# EAGLE design RFD900module (EAGLE 6.3)
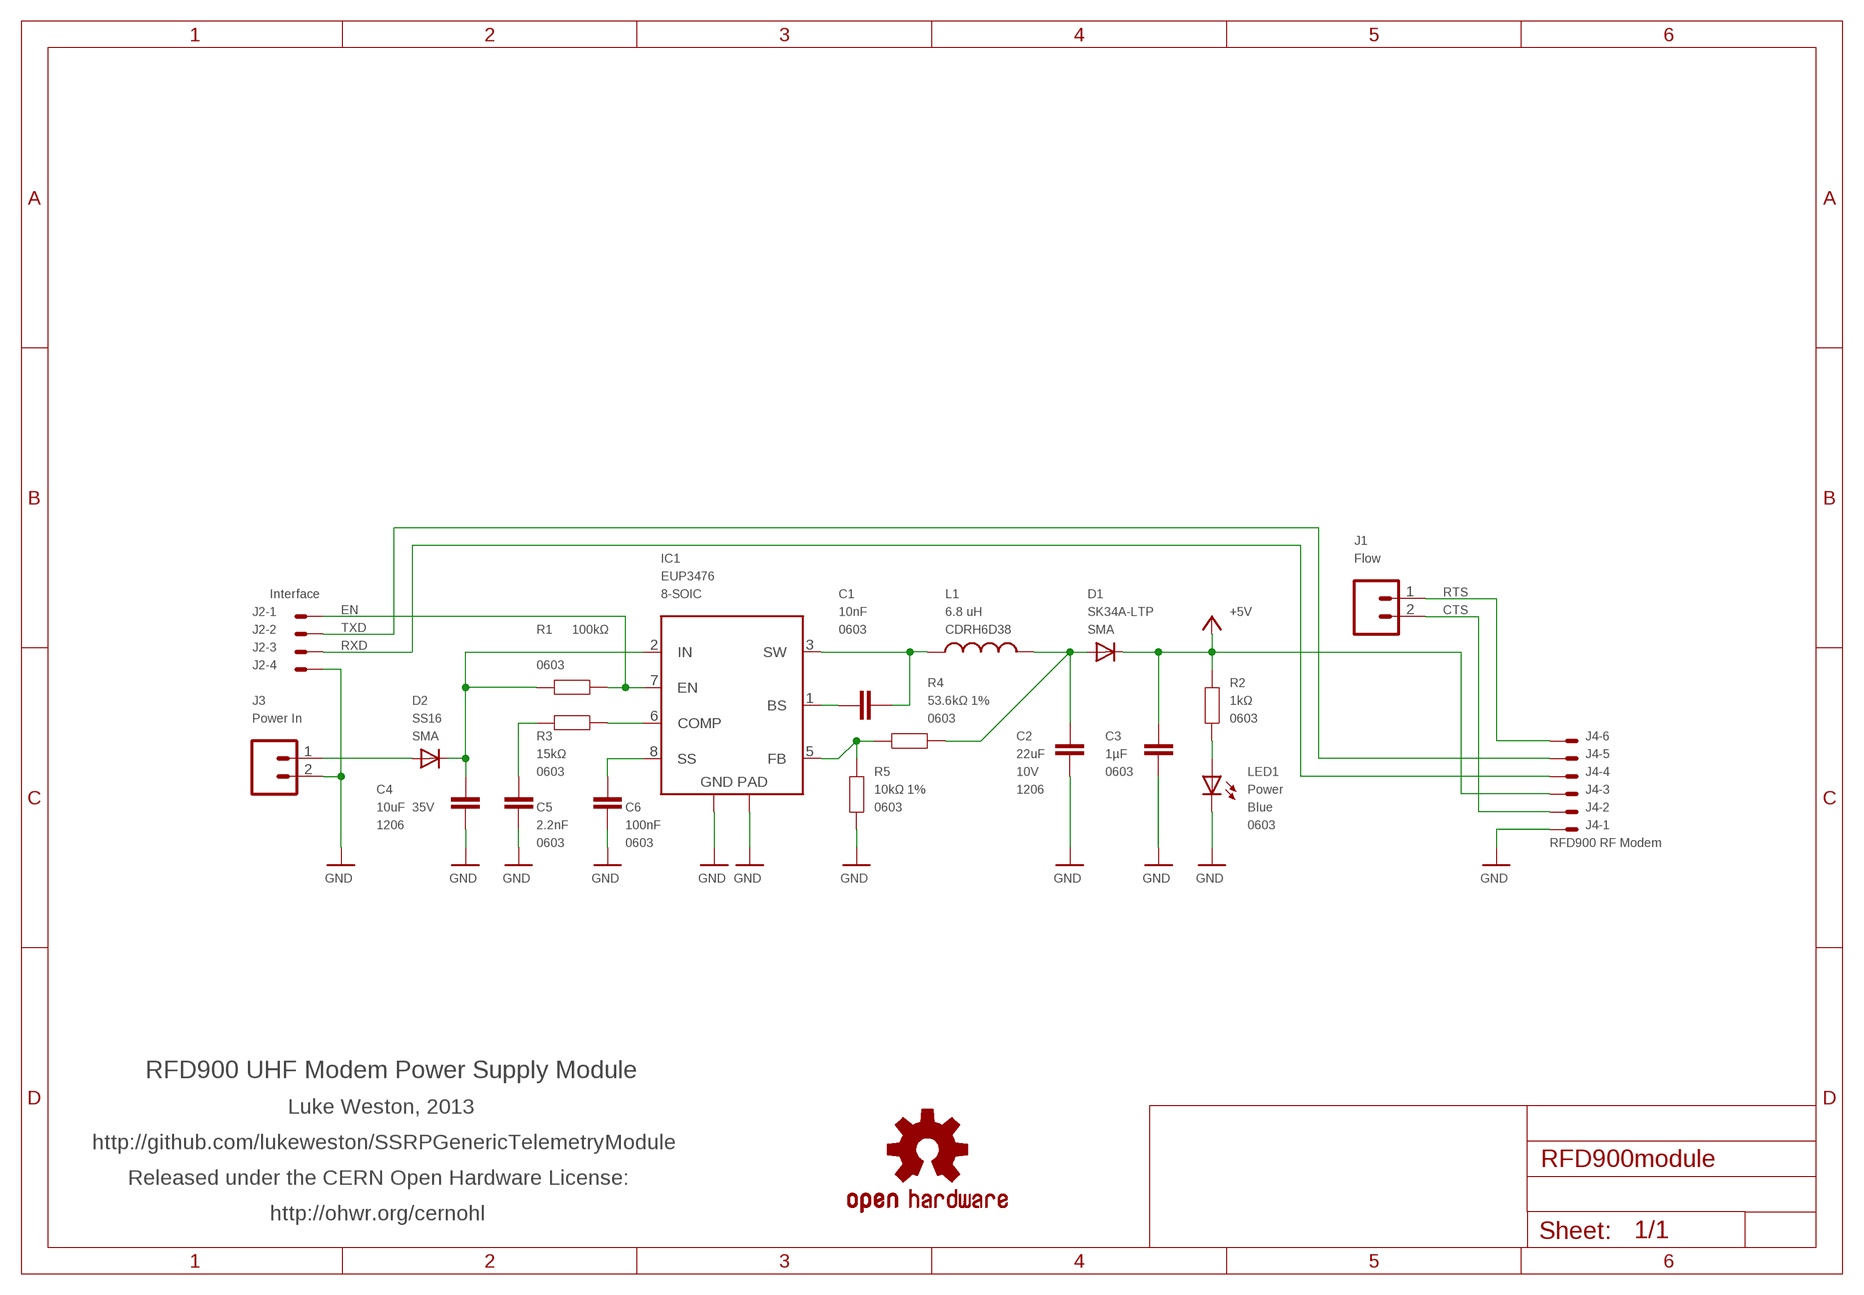
[diagram p0: schematic, sheet 1]

## Parts
C1  10nF  CAP0603  [0603]
C2  22uF  C-EUC1206  [C1206]
C3  1µF  CAP0603  [0603]
C4  10uF  C-EUC1206  [C1206]
C5  2.2nF  CAP0603  [0603]
C6  100nF  CAP0603  [0603]
D1  SK34A-LTP  DIODESMA  [SMA-DIODE]
D2  SS16  DIODESMAB  [SMA-SMB-DIODE]
IC1  EUP3476  [SO08T]
J1  Flow  M02PTH  [1X02]
J2  Interface  22-05-7048-04  [7395-04]
J3  Power In  M023.5MM  [SCREWTERMINAL-3.5MM-2]
J4  RFD900 RF Modem  22-05-7068-06  [7395-06]
L1  6.8 uH  INDUCTOR  [CDRH]
LED1  Power  LED0603  [LED-0603]
R1  100kΩ  RESISTOR0603  [0603]
R2  1kΩ  RESISTOR0603  [0603]
R3  15kΩ  RESISTOR0603  [0603]
R4  53.6kΩ 1%  RESISTOR0603  [0603]
R5  10kΩ 1%  RESISTOR0603  [0603]
SY  OSHW-LOGOS  [OSHW-LOGO-S]

## Nets
+5V: C3.2 D1.C J4.3 R2.1
CTS: J1.2 J4.2
EN: IC1.7(EN) J2.1 R1.1
GND: C2.2 C3.1 C4.2 C5.1 C6.1 IC1.4(GND) IC1.9(TGND) J2.4 J3.2 J4.1 LED1.C R5.2
N$1: D2.A J3.1
N$3: LED1.A R2.2
N$5: C2.1 D1.A L1.2 R4.2
N$18: C1.1 IC1.3(SW) L1.1
N$19: C1.2 IC1.1(BS)
N$20: C5.2 R3.2
N$21: IC1.6(COMP) R3.1
N$22: C6.2 IC1.8(SS)
N$23: IC1.5(FB) R4.1 R5.1
RTS: J1.1 J4.6
RXD: J2.3 J4.4
TXD: J2.2 J4.5
VIN: C4.1 D2.C IC1.2(IN) R1.2

## Notes on the sheet
- RFD900 UHF Modem Power Supply Module
- Luke Weston, 2013
- http://github.com/lukeweston/SSRPGenericTelemetryModule
- Released under the CERN Open Hardware License:
- http://ohwr.org/cernohl

## Library data of the parts
C1 C3 C5 C6 = freetronics-master-v1:CAP: Capacitor Standard 0603 ceramic capacitor, and 0.1" leaded capacitor.; PACKAGE: 0603
C2 = freetronics-jon:C-EU: CAPACITOR, European symbol; PACKAGE: 1206; VOLTAGE: 10V
C4 = freetronics-jon:C-EU: CAPACITOR, European symbol; PACKAGE: 1206; VOLTAGE: 35V
D1 = freetronics-master-v1:DIODE: Diode These are standard reverse protection diodes and small signal diodes. SMA package can handle up to about 1A. SOD-323 can handle about 200mA. What the SOD-323 package when ordering, there are some mfgs out there that are 5-pin packages.; PACKAGE: SMA
D2 = freetronics-jon:DIODE: Diode These are standard reverse protection diodes and small signal diodes. SMA package can handle up to about 1A. SOD-323 can handle about 200mA. What the SOD-323 package when ordering, there are some mfgs out there that are 5-pin packages.; PACKAGE: SMA
IC1 = freetronics-luke:EUP3476: EUTECH EUP3476 buck converter; PACKAGE: 8-SOIC
J1 J3 = freetronics-master-v1:M02: Header 2 Standard 2-pin 0.1" header. Use with straight break away headers (SKU : PRT-00116), right angle break away headers (PRT-00553), swiss pins (PRT-00743), machine pins (PRT-00117), and female headers (PRT-00115). Molex polarized connector foot print use with SKU : PRT-08233 with associated crimp pins and housings.
J2 = con-molex:22-?-04: CONNECTOR wire to board 2.54 mm (.1 inch) pitch header; OC_FARNELL: unknown; OC_NEWARK: unknown
J4 = con-molex:22-?-06: CONNECTOR wire to board 2.54 mm (.1 inch) pitch header; OC_FARNELL: unknown; OC_NEWARK: unknown
L1 = freetronics-luke:INDUCTOR; SKU: CDRH6D38
LED1 = freetronics-master-v1:LED: LEDs Standard schematic elements and footprints for 5mm, 3mm, 1206, and 0603 sized LEDs. 5mm - Spark Fun Electronics SKU : COM-00529 (and others); COLOUR: Blue; PACKAGE: 0603
R1-R5 = freetronics-master-v1:RESISTOR: Resistor Basic schematic elements and footprints for 0603, 1206, and PTH 1/10th watt (small) resistors.; PACKAGE: 0603
SY = SparkFun:OSHW-LOGO: Open Source Hardware Logo This logo indicates the piece of hardware it is found on incorporates a OSHW license and/or adheres to the definition of open source hardware found here: http://freedomdefined.org/OSHW

## Board
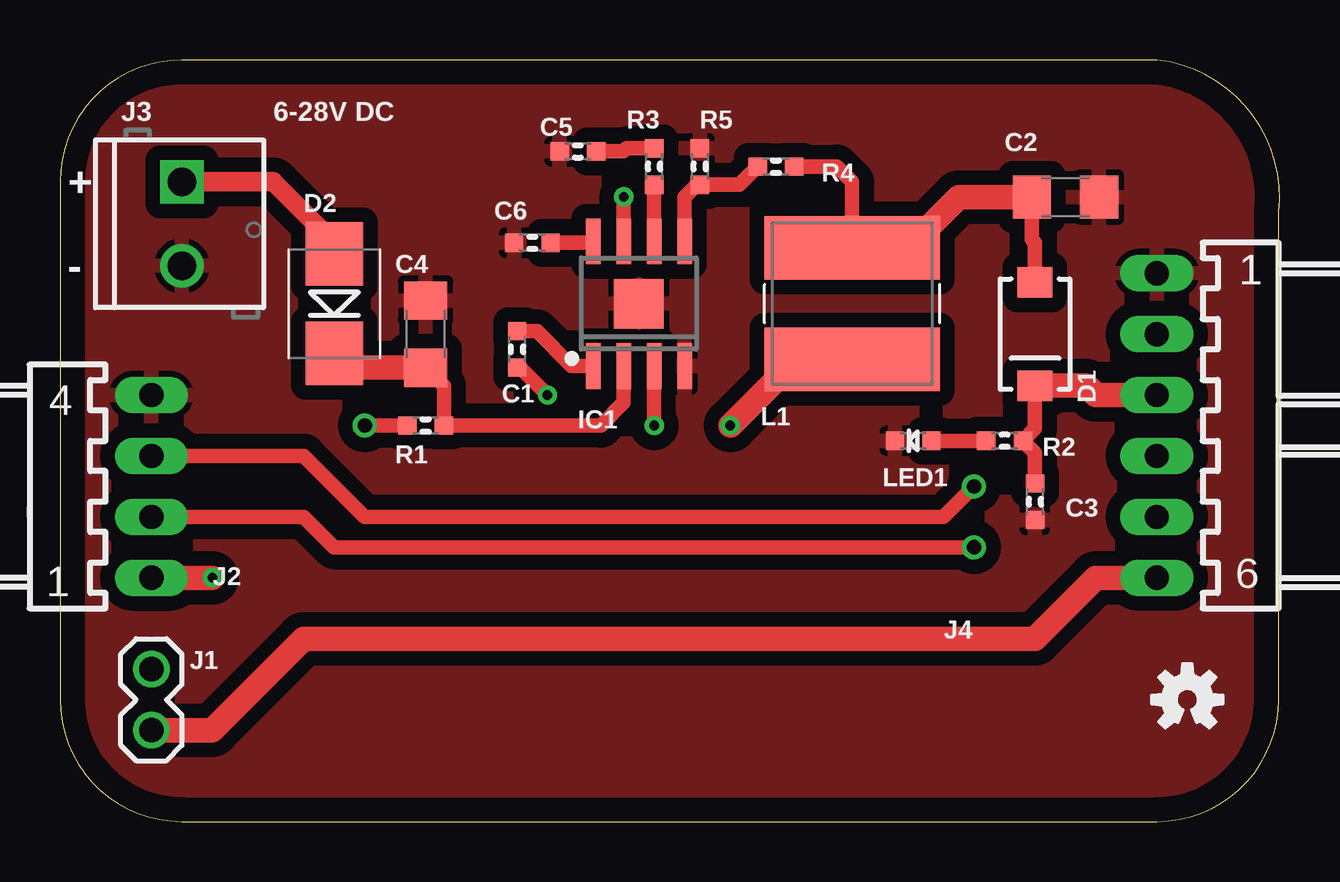
[diagram p1: board, top side]
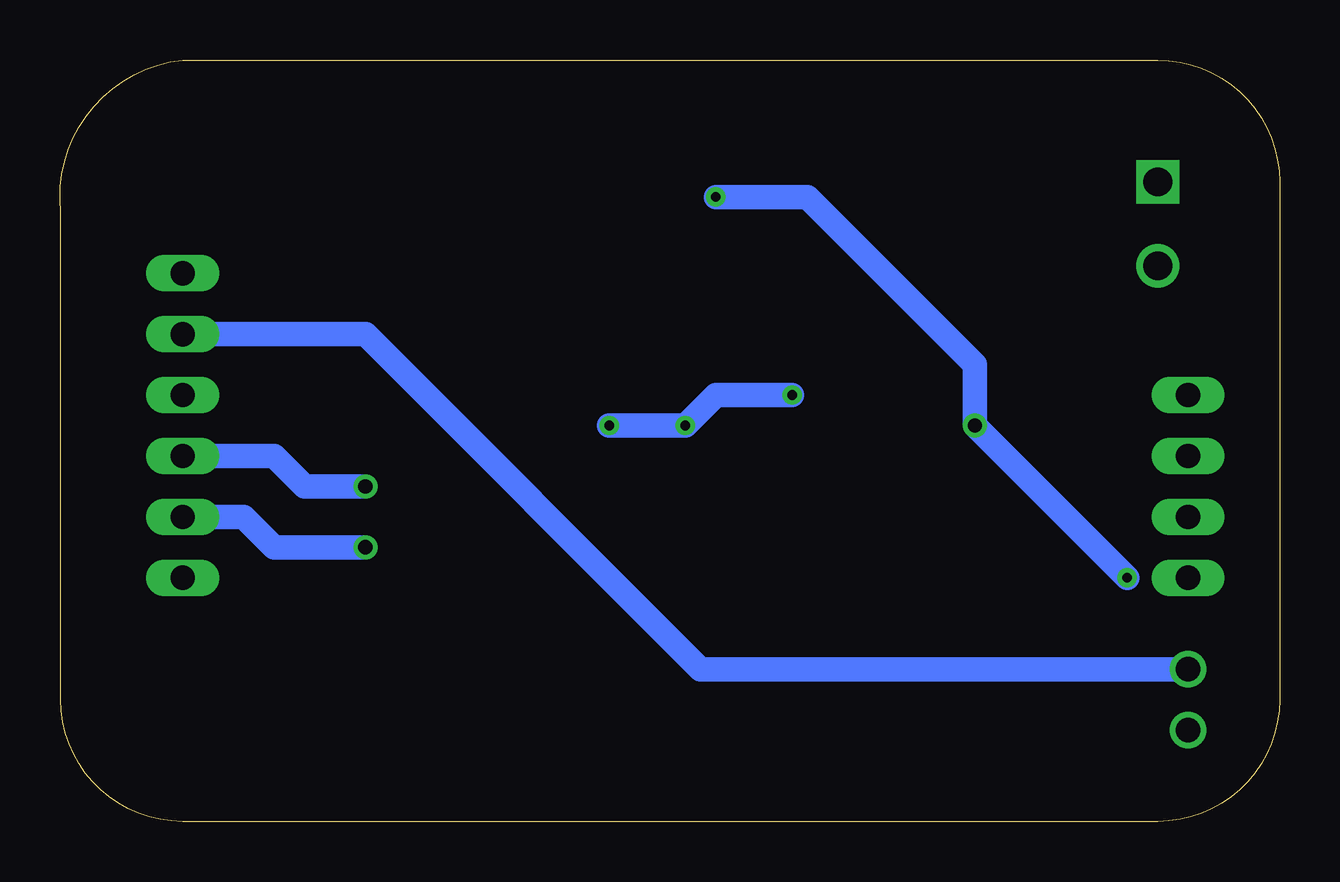
[diagram p2: board, bottom side, seen from below]

Size 50.83 x 31.75 mm. Coordinates in mm from the lower left corner, seen from the top.
Outline: 5.08,31.75 arc90 0,26.67 0,5.08 arc90 5.08,0 45.72,0 arc90 50.8,5.08 50.8,25.4 arc90 45.72,31.75 5.08,31.75
Copper layers (1*16): Top 0.035mm / dielectric 1.5mm / Bottom 0.035mm
Design rules "default": minimum track width 10mil, minimum drill 24mil, track to track 8mil, track to pad 8mil, pad to pad 8mil, via to via 8mil, smd to smd 8mil, copper to edge 40mil, drill to drill 8mil, minimum pad ring 10mil, minimum via ring 8mil, stop-mask expansion 4mil, vias tented up to drill 0mil, thermal gap 10mil

### Footprints (pad centres in the part's own frame; a part is rotated, then mirrored left to right if it is on the bottom)
0603 = smd 0.762 x 0.762: 1 -0.762,0; 2 0.762,0
C1206 = smd 1.6 x 1.8: 1 -1.4,0; 2 1.4,0
SMA-DIODE = smd 1.27 x 1.47: A -2.15,0; C 2.15,0
SMA-SMB-DIODE = smd 2.65 x 2.4: A 2.075,0; C -2.075,0
SO08T = smd 1.905 x 0.6: 1 -2.6,1.905; 2 -2.6,0.635; 3 -2.6,-0.635; 4 -2.6,-1.905; 5 2.6,-1.905; 6 2.6,-0.635; 7 2.6,0.635; 8 2.6,1.905 | smd 2.057 x 2.057: 9 0,0
1X02 = drill 1.016: 1 0,0; 2 2.54,0
7395-04 = drill 1.016 long: 1 3.81,0; 2 1.27,0; 3 -1.27,0; 4 -3.81,0
SCREWTERMINAL-3.5MM-2 = drill 1.2 square: 1 0,0 | drill 1.2: 2 3.5,0
7395-06 = drill 1.016 long: 1 6.35,0; 2 3.81,0; 3 1.27,0; 4 -1.27,0; 5 -3.81,0; 6 -6.35,0
CDRH = smd 7.3 x 2.65: 1 0,2.325; 2 0,-2.325
LED-0603 = smd 0.762 x 0.762: A -0.762,0; C 0.762,0

### Placement (x,y rotation side)
C1  19.05,19.68 90 top
C2  41.91,26.04 0 top
C3  40.64,13.34 90 top
C4  15.24,20.32 90 top
C5  21.59,27.94 0 top
C6  19.68,24.13 0 top
D1  40.64,20.32 270 top
D2  11.43,21.59 90 top
IC1  24.13,21.59 90 top
J1  3.81,3.81 90 top
J2  3.81,13.97 270 top
J3  5.08,26.67 270 top
J4  45.72,16.51 90 top
L1  33.02,21.59 180 top
LED1  35.56,15.88 180 top
R1  15.24,16.51 0 top
R2  39.37,15.88 180 top
R3  24.77,27.3 90 top
R4  29.84,27.3 0 top
R5  26.67,27.3 90 top
SY  46.99,5.08 0 top

### Tracks (layer width: path | path; a pad name or v marks a point on that pad's centre or on a via)
+5V
  Top 0.61: D1.C 40.64,16.38 R2.1 40.64,15.37 C3.2
  Top 1.016: D1.C 42.79,18.17 43.18,17.78 J4.3
CTS
  Bottom 1.016: J4.2 38.1,20.32 24.13,6.35 J1.2
EN  (via drill 0.4, 0.6)
  Top 0.61: v23.5,26.04 IC1.7 | R1.1 v12.7,16.51
  Top 1.016: J2.1 v6.35,10.16
  Bottom 1.016: v6.35,10.16 v12.7,16.51 12.7,19.05 19.68,26.04 v23.5,26.04
GND
  pour Top (isolate 0.61): -1.27,33.02 52.07,33.02 52.07,-1.27 -1.27,-1.27
N$1
  Top 0.813: J3.1 8.89,26.67 11.43,24.13 D2.A
N$3
  Top 0.61: R2.2 LED1.A
N$5
  Top 0.61: C2.1 40.51,24.26 40.64,24.13 D1.A | 35.34,23.91 L1.2 33.02,26.67 32.38,27.3 R4.2
  Top 1.016: 35.34,23.91 37.46,26.04 C2.1
N$18  (via drill 0.4)
  Top 0.61: v24.77,16.51 IC1.3 | L1.1 30.7,19.27 | C1.1 19.18,18.92 v20.32,17.78
  Top 1.016: 30.7,19.27 v27.94,16.51
  Bottom 1.016: v20.32,17.78 23.5,17.78 v24.77,16.51 v27.94,16.51
N$19
  Top 0.61: C1.2 19.88,20.45 21.33,18.99 IC1.1
N$20
  Top 0.61: R3.2 23.62,28.07 23.5,27.94 C5.2
N$21
  Top 0.61: R3.1 IC1.6
N$22
  Top 0.61: C6.2 22.16,24.13 IC1.8
N$23
  Top 0.61: IC1.5 26.04,26.04 26.54,26.54 R5.1 28.32,26.54 R4.1
RTS
  Top 1.016: J1.1 6.35,3.81 10.16,7.62 40.64,7.62 43.18,10.16 J4.6
RXD  (via drill 0.6)
  Top 0.61: v38.1,13.97 36.83,12.7 12.7,12.7 10.16,15.24 J2.3
  Bottom 1.016: v38.1,13.97 40.64,13.97 41.91,15.24 J4.4
TXD  (via drill 0.6)
  Top 0.61: J2.2 10.16,12.7 11.43,11.43 v38.1,11.43
  Bottom 1.016: v38.1,11.43 41.91,11.43 43.18,12.7 J4.5
VIN
  Top 0.61: IC1.2 23.5,17.46 22.54,16.51 R1.2 16,18.16 C4.1
  Top 1.016: C4.1 12.2,18.92 11.6,19.52 D2.C

### Text on the board
tPlace: 6-28V DC | + | -